# Altium schematic sheet UserInterface.SchDoc
size A4; SheetNumber: 11; SheetTotal: 14
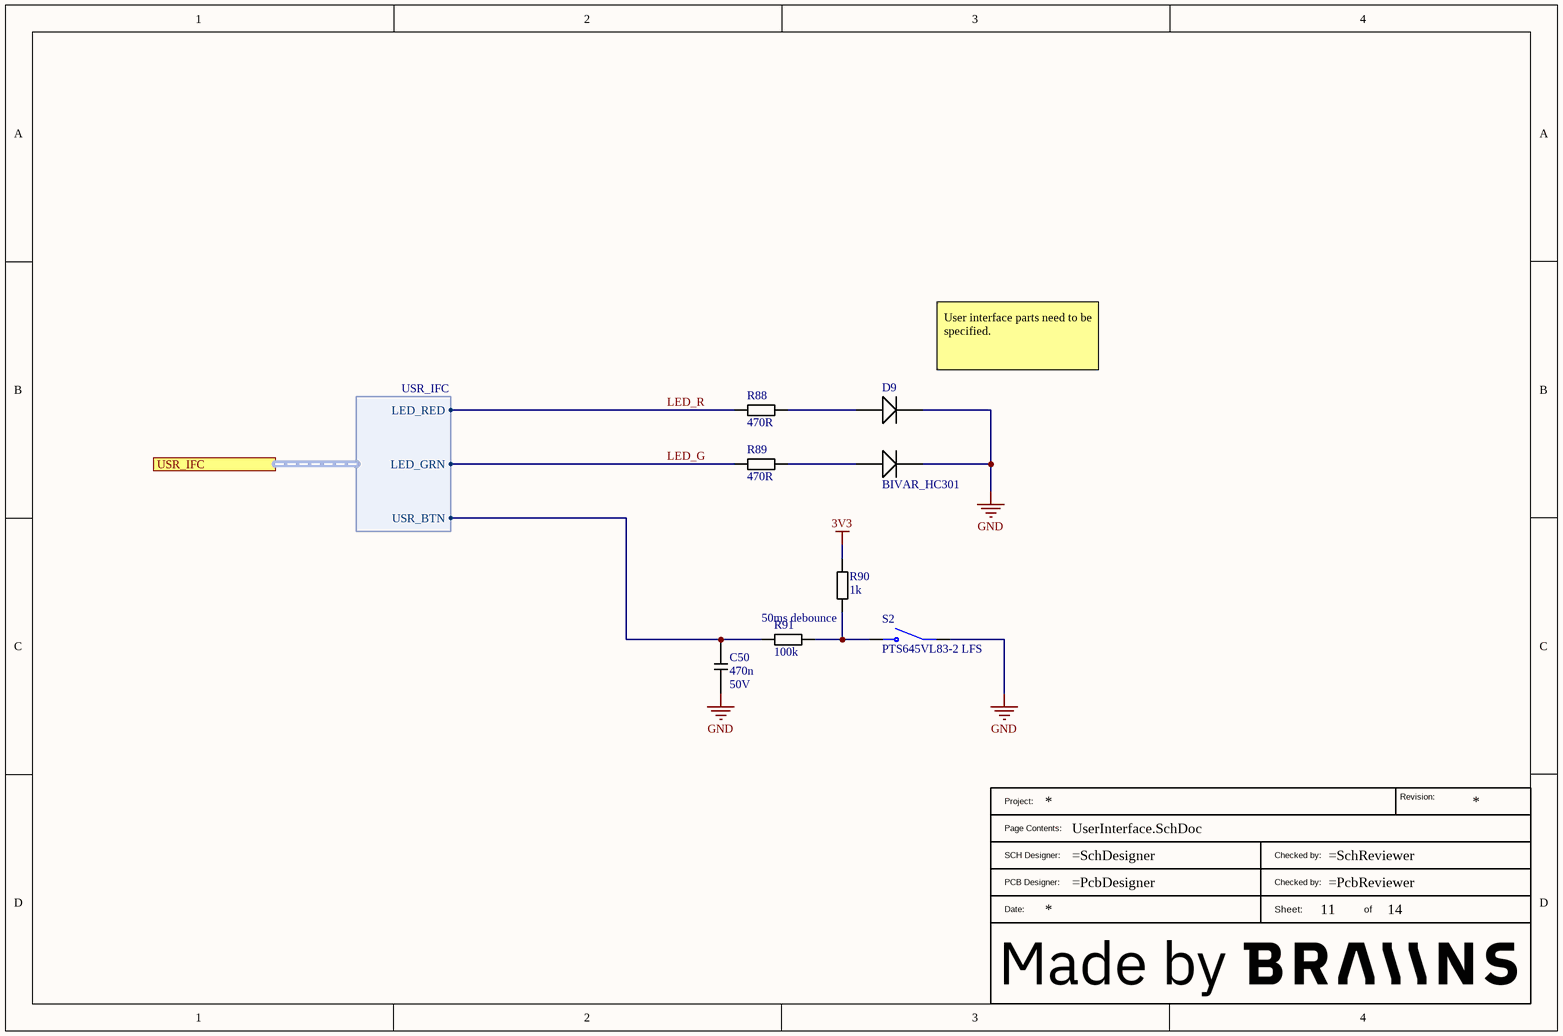
[diagram p0: UserInterface.SchDoc]

## Parts
?  BraiinsTitleBlockWithLogo  (value not drawn)  (graphical)
C50  Voltage_Rating: 50V  [CAP0603]  (hidden comment: 470n)
D9  BIVAR_HC301  [BIVAR_HC301]
R88  470R  [RES0402]
R89  470R  [RES0402]
R90  1k  [RES0402]
R91  100k  [RES0402]
S2  PTS645VL83-2 LFS  [THT_TACTILE_75x45_8mm35]

## Ports
USR_IFC (harness USR_IFC)

## Harnesses
USR_IFC: LED_RED, LED_GRN, USR_BTN

## Nets
3V3: R90.2
GND: C50.2 D9.2(C) D9.4(C) S2.1
LED_G: R89.1 ; port USR_IFC.LED_GRN
LED_R: R88.1 ; port USR_IFC.LED_RED
NetC50_1: C50.1 R91.2 ; port USR_IFC.USR_BTN
NetD9_1: D9.1(A) R88.2
NetD9_3: D9.3(A) R89.2
NetR90_1: R90.1 R91.1 S2.2

## Notes on the sheet
- User interface parts need to be specified.
- 50ms debounce
- (in symbol BraiinsTitleBlockWithLogo) Revision:; Project:; Page Contents:; SCH Designer:; Checked by:; PCB Designer:; Date:; Sheet:; of

## Library data of the parts
C50 = 30133: CAP CER 470n 10% 50V 0603; Part_Type: Capacitor; Part_Status: New; ID: 30133; Updated By: janjuranek; Sorted_Value: 470; Value: 470n; Sub_Type: CER; Manufacturer Part Description: CAP CER 470n 10% 50V 0603; Package_Case: 0603; RoHS: Yes; Tolerance: 10%; Created By: janjuranek; Created_Date: 2023-04-04 16:57:09; Updated_Date: 2023-04-04 16:57:39; ComponentLink1Description: Datasheet; ComponentLink2Description: Supplier Part Details
D9 = 30151: DUAL LED TERMINAL; Manufacturer: BIVAR; Part_Status: New; ID: 30151; Updated By: janjuranek; Notes: probably not right footprint.; Value: BIVAR_HC301; Manufacturer Part Number: BIVAR_HC301; Manufacturer Part Description: DUAL LED TERMINAL; Created By: janjuranek; Created_Date: 2023-04-27 16:22:05; Updated_Date: 2023-04-27 16:22:48; ComponentLink1Description: Datasheet; ComponentLink2Description: Supplier Part Details
R88 R89 = 30084: RES 470R Ohm 1% 0402; Part_Status: New; ID: 30084; Updated By: Jan; Sorted_Value: 470; Value: 470R; Part_Type: Resistor; Manufacturer Part Description: RES 470R Ohm 1% 0402; Package_Case: 0402; RoHS: Yes; Tolerance: 1%; Created By: Jan; Created_Date: 2023-03-02 16:05:04; Updated_Date: 2023-03-02 16:05:22; ComponentLink1Description: Datasheet; ComponentLink2Description: Supplier Part Details
R90 = 30070: RES 1k Ohm 1% 0402; Part_Status: New; ID: 30070; Updated By: Jan; Sorted_Value: 1000; Value: 1k; Part_Type: Resistor; Manufacturer Part Description: RES 1k Ohm 1% 0402; Package_Case: 0402; RoHS: Yes; Tolerance: 1%; Created By: Jan; Created_Date: 2023-03-02 13:13:07; Updated_Date: 2023-03-02 13:13:47; ComponentLink1Description: Datasheet; ComponentLink2Description: Supplier Part Details; Temperature Range: -40 to +150C
R91 = 30079: RES 100k Ohm 1% 0402; Part_Status: New; ID: 30079; Updated By: Jan; Sorted_Value: 100000; Value: 100k; Part_Type: Resistor; Manufacturer Part Description: RES 100k Ohm 1% 0402; Package_Case: 0402; RoHS: Yes; Tolerance: 1%; Created By: Jan; Created_Date: 2023-03-02 15:13:26; Updated_Date: 2023-03-02 15:13:51; ComponentLink1Description: Datasheet; ComponentLink2Description: Supplier Part Details
S2 = 30182: SWITCH TACTILE SPST-NO 0.05A 12V, LEVER 8.35mm; Part_Status: New; ID: 30182; Updated By: janjuranek; Value: PTS645VL83-2 LFS; Part_Type: Switch; Manufacturer Part Number: PTS645VL83-2 LFS; Manufacturer Part Description: SWITCH TACTILE SPST-NO 0.05A 12V, LEVER 8.35mm; RoHS: Yes; Created By: janjuranek; Created_Date: 2023-05-17 17:51:23; Updated_Date: 2023-05-17 17:53:09; ComponentLink1Description: Datasheet; ComponentLink2Description: Supplier Part Details